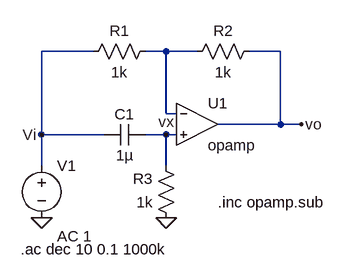
[diagram p0: schematic PasaTodo.asc]
PasaTodo.asc, the LTspice schematic file:
Version 4
SHEET 1 880 680
WIRE 144 -16 64 -16
WIRE 256 -16 224 -16
WIRE 304 -16 256 -16
WIRE 432 -16 384 -16
WIRE 256 80 256 -16
WIRE 272 80 256 80
WIRE 432 96 432 -16
WIRE 432 96 336 96
WIRE 464 96 432 96
WIRE 64 112 64 -16
WIRE 160 112 64 112
WIRE 256 112 224 112
WIRE 272 112 256 112
WIRE 64 160 64 112
WIRE 256 160 256 112
FLAG 256 240 0
FLAG 64 240 0
FLAG 464 96 vo
FLAG 256 112 vx
FLAG 64 112 Vi
SYMBOL voltage 64 144 R0
WINDOW 123 24 124 Left 2
WINDOW 39 0 0 Left 0
SYMATTR Value2 AC 1
SYMATTR InstName V1
SYMATTR Value ""
SYMBOL res 240 -32 R90
WINDOW 0 0 56 VBottom 2
WINDOW 3 32 56 VTop 2
SYMATTR InstName R1
SYMATTR Value 1k
SYMBOL cap 224 96 R90
WINDOW 0 0 32 VBottom 2
WINDOW 3 32 32 VTop 2
SYMATTR InstName C1
SYMATTR Value 1µ
SYMBOL res 400 -32 R90
WINDOW 0 0 56 VBottom 2
WINDOW 3 32 56 VTop 2
SYMATTR InstName R2
SYMATTR Value 1k
SYMBOL res 272 256 R180
WINDOW 0 36 76 Left 2
WINDOW 3 36 40 Left 2
SYMATTR InstName R3
SYMATTR Value 1k
SYMBOL OpAmps\\opamp 304 32 R0
SYMATTR InstName U1
TEXT 32 288 Left 2 !.ac dec 10 0.1 1000k
TEXT 336 216 Left 2 !.inc opamp.sub

The netlist it stands for:
* PasaTodo.asc
V1 Vi 0 AC 1
R1 N001 Vi 1k
C1 vx Vi 1µ
R2 vo N001 1k
R3 0 vx 1k
XU1 N001 vx vo opamp Aol=100K GBW=10Meg  ; pins invin noninvin out
.ac dec 10 0.1 1000k
.inc opamp.sub
.backanno
.end